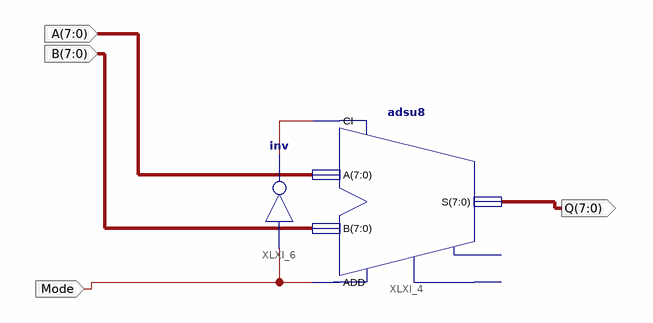
[diagram p0: schematic sheet 1]
// Xilinx ISE schematic arith.sch (spartan6) as structural Verilog: 2 symbols, 4 ports
module arith (
  input  [7:0] A,
  input  [7:0] B,
  input  Mode,
  output [7:0] Q
);

  wire XLXN_26;

  adsu8 XLXI_4 (.A(A), .ADD(Mode), .B(B), .CI(XLXN_26), .S(Q));  // open: CO, OFL
  not XLXI_6 (XLXN_26, Mode);
endmodule
